# EAGLE schematic maintenance_panel (EAGLE 6.6.0)
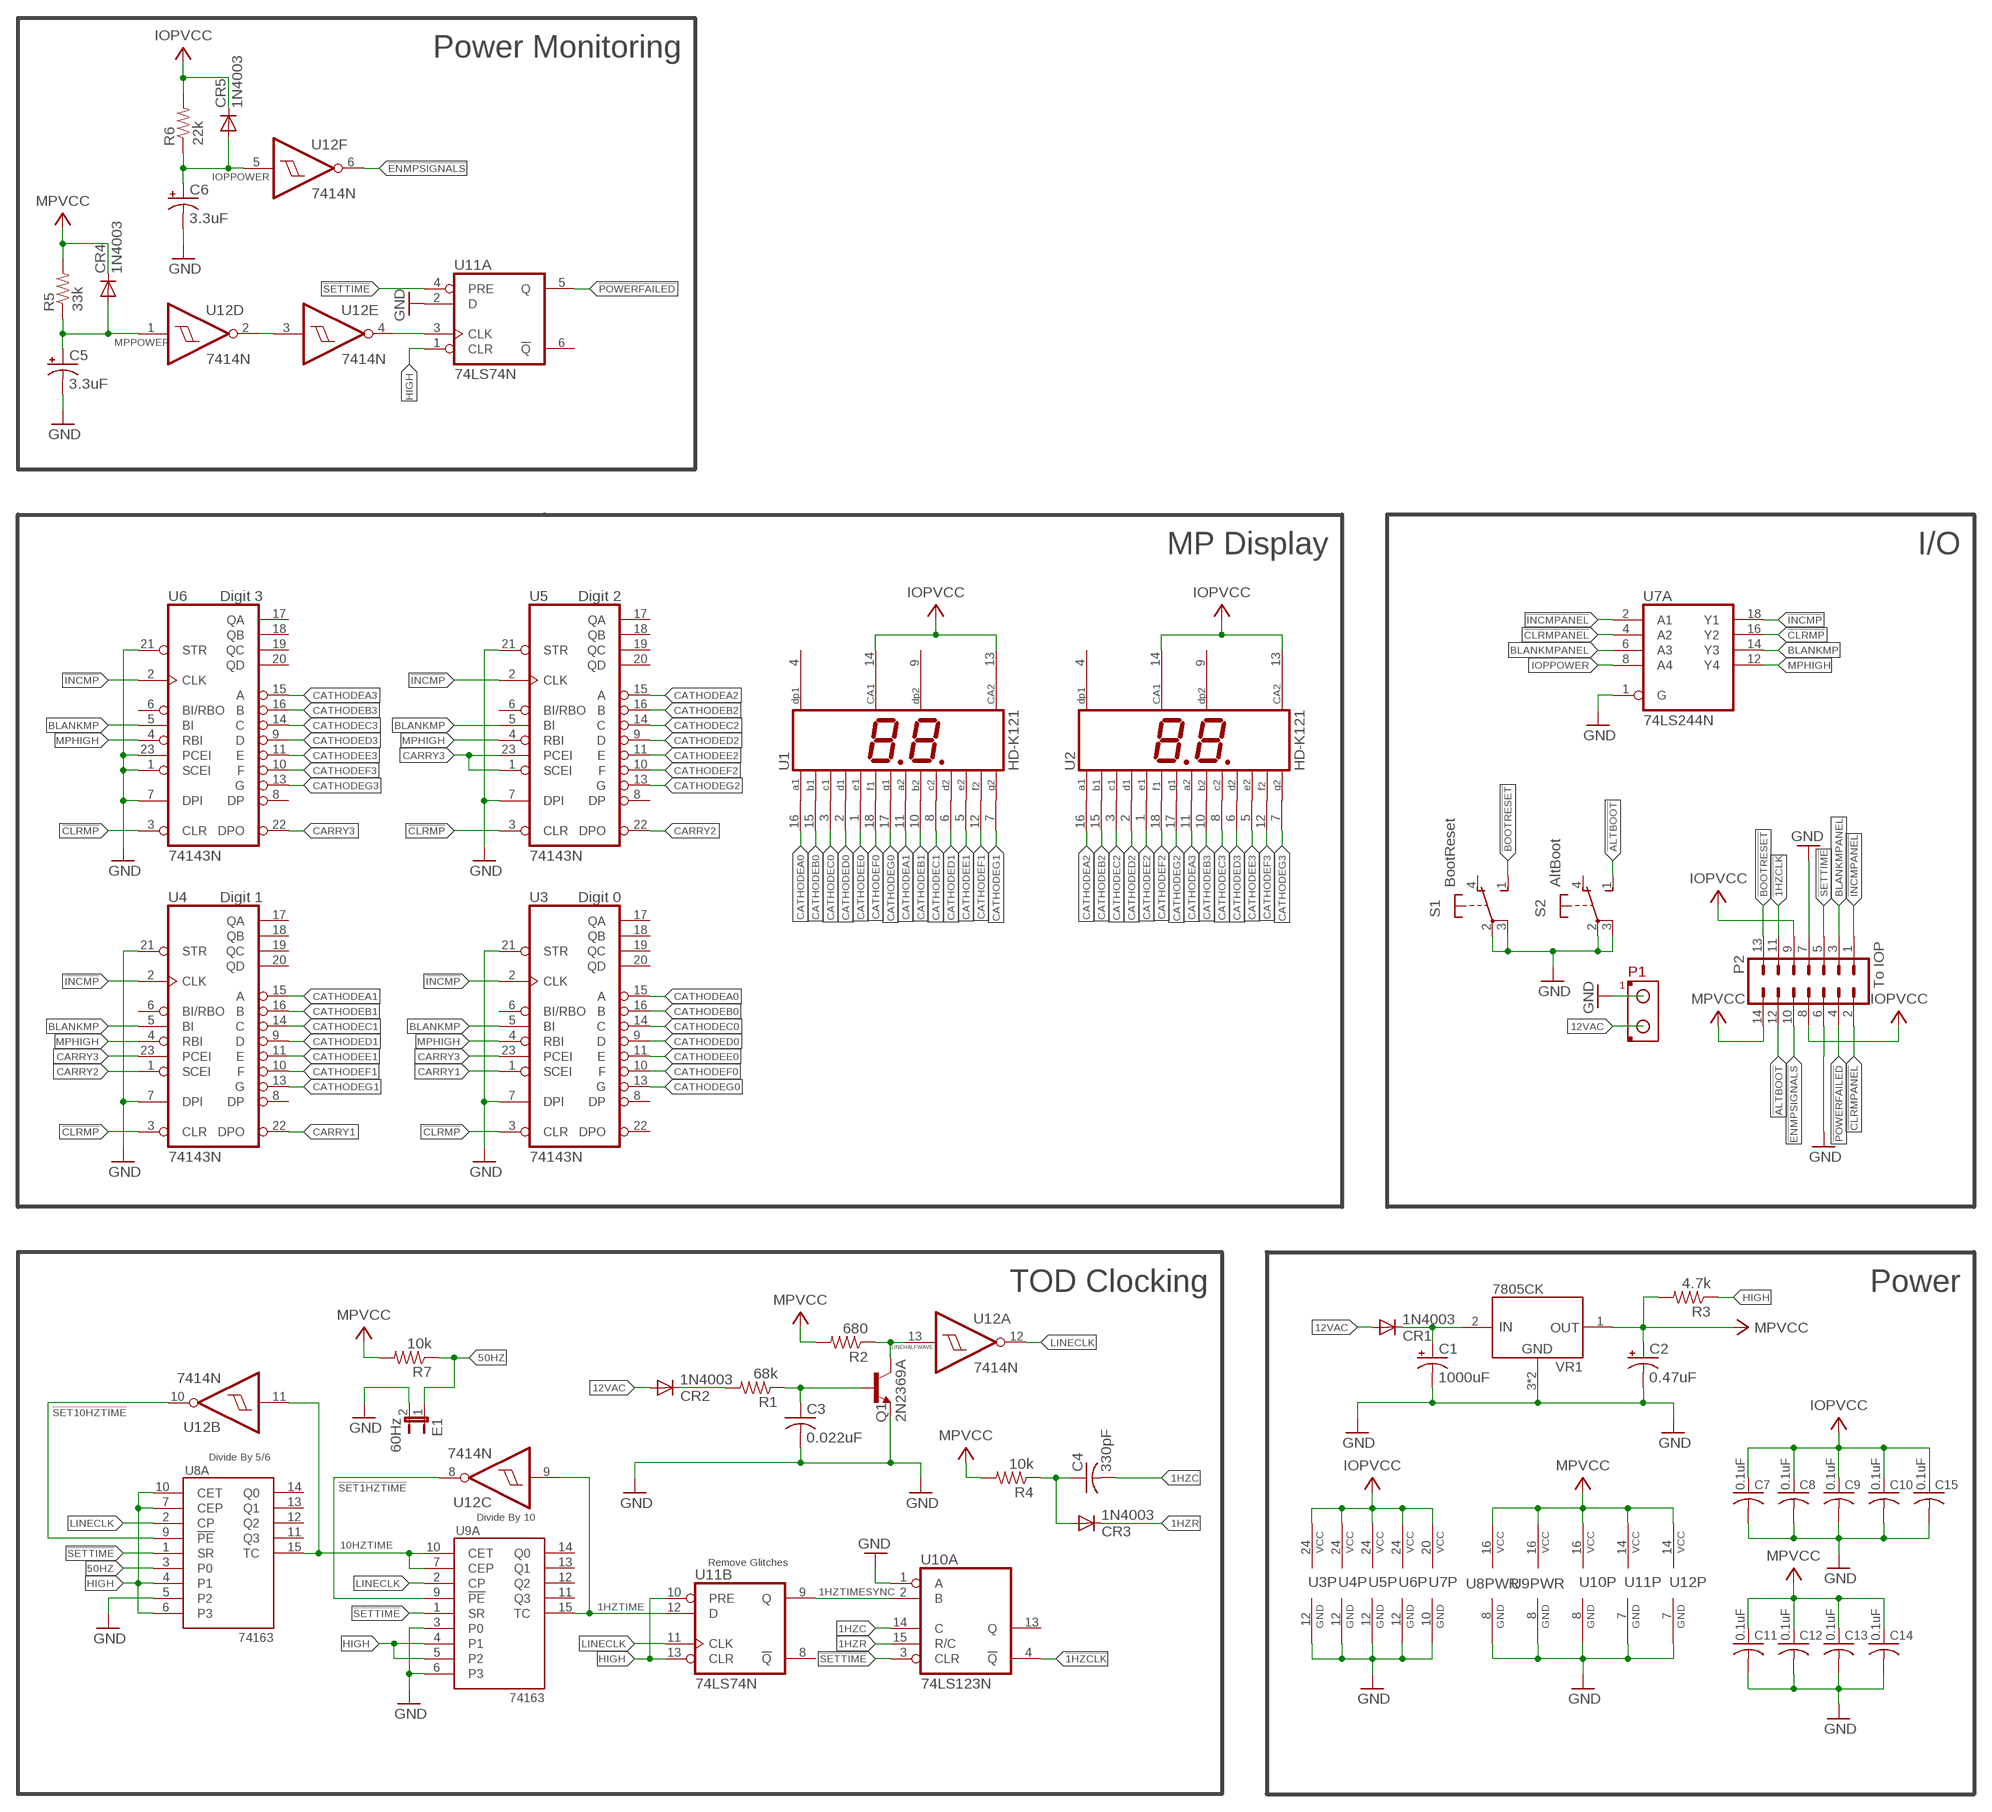
[diagram p0: schematic, sheet 1]

## Parts
C1  1000uF  CPOL-USE25-10AXIAL  [E25-10]
C2  0.47uF  CPOL-USE15-5AXIAL  [E15-5]
C3  0.022uF  C-US075-052X106  [C075-052X106]
C4  330pF  C-US075-032X103  [C075-032X103]
C5  3.3uF  CPOL-USE15-5AXIAL  [E15-5]
C6  3.3uF  CPOL-USE15-5AXIAL  [E15-5]
C7  0.1uF  C-US075-032X103  [C075-032X103]
C8  0.1uF  C-US075-032X103  [C075-032X103]
C9  0.1uF  C-US075-032X103  [C075-032X103]
C10  0.1uF  C-US075-032X103  [C075-032X103]
C11  0.1uF  C-US075-032X103  [C075-032X103]
C12  0.1uF  C-US075-032X103  [C075-032X103]
C13  0.1uF  C-US075-032X103  [C075-032X103]
C14  0.1uF  C-US075-032X103  [C075-032X103]
C15  0.1uF  C-US075-032X103  [C075-032X103]
CR1  1N4003  1N4004  [DO41-10]
CR2  1N4003  1N4004  [DO41-10]
CR3  1N4003  1N4004  [DO41-10]
CR4  1N4003  1N4004  [DO41-10]
CR5  1N4003  1N4004  [DO41-10]
E1  60Hz  JP1E  [JP1]
P1  XEROX-RTC-2X1  [XEROX-RTC-2X1]
P2  To IOP  MA07-2  [MA07-2]
Q1  2N2369A  2N2369A-NPN-TO18-EBC  [TO18]
R1  68k  R-US_0207/10  [0207/10]
R2  680  R-US_0207/10  [0207/10]
R3  4.7k  R-US_0207/10  [0207/10]
R4  10k  R-US_0207/10  [0207/10]
R5  33k  R-US_0207/10  [0207/10]
R6  22k  R-US_0207/10  [0207/10]
R7  10k  R-US_0207/10  [0207/10]
S1  BootReset  SRK  [SRK]
S2  AltBoot  SRK  [SRK]
U1  HD-K121  [HDSP-R]
U2  HD-K121  [HDSP-R]
U3  74143N  [DIL24-6]
U4  74143N  [DIL24-6]
U5  74143N  [DIL24-6]
U6  74143N  [DIL24-6]
U7  74LS244N  [DIL20]
U8  74163  [DIL16]
U9  74163  [DIL16]
U10  74LS123N  [DIL16]
U11  74LS74N  [DIL14]
U12  7414N  [DIL14]
VR1  7805CK  [TO3-78]

## Nets
1HZC: C4.2 U10.14(A:C)
1HZR: CR3.C U10.15(A:R/C)
1HZTIME: U9.15(A:TC) U11.12(B:D) U12.9(C:I)
1HZTIMESYNC: U10.2(A:B) U11.9(B:Q)
10HZTIME: U8.15(A:TC) U9.7(A:CEP) U9.10(A:CET) U12.11(B:I)
12VAC: CR1.A CR2.A P1.2
50HZ: E1.1 R7.1 U8.3(A:P0)
!1HZCLK: P2.11 U10.4(A:!Q)
!ALTBOOT: P2.12 S2.1(S)
!BOOTRESET: P2.13 S1.1(S)
!CLRMP: U3.3(CLR) U4.3(CLR) U5.3(CLR) U6.3(CLR) U7.16(A:Y2)
!CLRMPANEL: P2.2 U7.4(A:A2)
!ENMPSIGNALS: P2.10 U12.6(F:O)
!INCMP: U3.2(CLK) U4.2(CLK) U5.2(CLK) U6.2(CLK) U7.18(A:Y1)
!INCMPANEL: P2.1 U7.2(A:A1)
!POWERFAILED: P2.4 U11.5(A:Q)
!SET1HZTIME: U9.9(A:!PE) U12.8(C:O)
!SET10HZTIME: U8.9(A:!PE) U12.10(B:O)
!SETTIME: P2.5 U8.1(A:SR) U9.1(A:SR) U10.3(A:CLR) U11.4(A:PRE)
+12VAC: C1.+ CR1.C VR1.2(IN)
+12VAC-2: CR2.C R1.2
BLANKMP: U3.5(BI) U4.5(BI) U5.5(BI) U6.5(BI) U7.14(A:Y3)
BLANKMPANEL: P2.3 U7.6(A:A3)
CARRY1: U3.1(SCEI) U4.22(DPO)
CARRY2: U4.1(SCEI) U5.22(DPO)
CARRY3: U3.23(PCEI) U4.23(PCEI) U5.1(SCEI) U5.23(PCEI) U6.22(DPO)
CATHODEA0: U1.16(A1) U3.15(A)
CATHODEA1: U1.11(A2) U4.15(A)
CATHODEA2: U2.16(A1) U5.15(A)
CATHODEA3: U2.11(A2) U6.15(A)
CATHODEB0: U1.15(B1) U3.16(B)
CATHODEB1: U1.10(B2) U4.16(B)
CATHODEB2: U2.15(B1) U5.16(B)
CATHODEB3: U2.10(B2) U6.16(B)
CATHODEC0: U1.3(C1) U3.14(C)
CATHODEC1: U1.8(C2) U4.14(C)
CATHODEC2: U2.3(C1) U5.14(C)
CATHODEC3: U2.8(C2) U6.14(C)
CATHODED0: U1.2(D1) U3.9(D)
CATHODED1: U1.6(D2) U4.9(D)
CATHODED2: U2.2(D1) U5.9(D)
CATHODED3: U2.6(D2) U6.9(D)
CATHODEE0: U1.1(E1) U3.11(E)
CATHODEE1: U1.5(E2) U4.11(E)
CATHODEE2: U2.1(E1) U5.11(E)
CATHODEE3: U2.5(E2) U6.11(E)
CATHODEF0: U1.18(F1) U3.10(F)
CATHODEF1: U1.12(F2) U4.10(F)
CATHODEF2: U2.18(F1) U5.10(F)
CATHODEF3: U2.12(F2) U6.10(F)
CATHODEG0: U1.17(G1) U3.13(G)
CATHODEG1: U1.7(G2) U4.13(G)
CATHODEG2: U2.17(G1) U5.13(G)
CATHODEG3: U2.7(G2) U6.13(G)
GND: C1.- C2.- C3.2 C5.- C6.- C7.2 C8.2 C9.2 C10.2 C11.2 C12.2 C13.2 C14.2 C15.2 E1.2 P1.1 P2.6 P2.7 Q1.1(E) S1.2(P) S1.3(P) S2.2(P) S2.3(P) U3.7(DPI) U3.12(GND) U3.21(STR) U4.7(DPI) U4.12(GND) U4.21(STR) U5.7(DPI) U5.12(GND) U5.21(STR) U6.1(SCEI) U6.7(DPI) U6.12(GND) U6.21(STR) U6.23(PCEI) U7.1(A:G) U7.10(P:GND) U8.5(A:P2) U8.8(PWR:GND) U9.3(A:P0) U9.6(A:P3) U9.8(PWR:GND) U10.1(A:A) U10.8(P:GND) U11.2(A:D) U11.7(P:GND) U12.7(P:GND) VR1.3(GND) VR1.3@(GND)
HIGH: R3.1 U8.4(A:P1) U8.6(A:P3) U8.7(A:CEP) U8.10(A:CET) U9.4(A:P1) U9.5(A:P2) U11.1(A:CLR) U11.10(B:PRE) U11.13(B:CLR)
IOPPOWER: C6.+ CR5.A R6.1 U7.8(A:A4) U12.5(F:I)
IOPVCC: C7.1 C8.1 C9.1 C10.1 C15.1 CR5.C P2.8 P2.9 R6.2 U1.13(CA2) U1.14(CA1) U2.13(CA2) U2.14(CA1) U3.24(VCC) U4.24(VCC) U5.24(VCC) U6.24(VCC) U7.20(P:VCC)
LINECLK: U8.2(A:CP) U9.2(A:CP) U11.11(B:CLK) U12.12(A:O)
LINEHALFWAVE: Q1.3(C) R2.1 U12.13(A:I)
LINEHALFWAVE-PREQ: C3.1 Q1.2(B) R1.1
MPHIGH: U3.4(RBI) U4.4(RBI) U5.4(RBI) U6.4(RBI) U7.12(A:Y4)
MPP1: U12.2(D:O) U12.3(E:I)
MPP2: U11.3(A:CLK) U12.4(E:O)
MPPOWER: C5.+ CR4.A R5.1 U12.1(D:I)
MPVCC: C2.+ C11.1 C12.1 C13.1 C14.1 CR4.C P2.14 R2.2 R3.2 R4.2 R5.2 R7.2 U8.16(PWR:VCC) U9.16(PWR:VCC) U10.16(P:VCC) U11.14(P:VCC) U12.14(P:VCC) VR1.1(OUT)
N$1: C4.1 CR3.A R4.1
Unconnected: S1.4(O) S2.4(O) U1.4(DP1) U1.9(DP2) U2.4(DP1) U2.9(DP2) U3.6(BI/RBO) U3.8(DP) U3.17(QA) U3.18(QB) U3.19(QC) U3.20(QD) U3.22(DPO) U4.6(BI/RBO) U4.8(DP) U4.17(QA) U4.18(QB) U4.19(QC) U4.20(QD) U5.6(BI/RBO) U5.8(DP) U5.17(QA) U5.18(QB) U5.19(QC) U5.20(QD) U6.6(BI/RBO) U6.8(DP) U6.17(QA) U6.18(QB) U6.19(QC) U6.20(QD) U7.3(B:Y4) U7.5(B:Y3) U7.7(B:Y2) U7.9(B:Y1) U7.11(B:A1) U7.13(B:A2) U7.15(B:A3) U7.17(B:A4) U7.19(B:G) U8.11(A:Q3) U8.12(A:Q2) U8.13(A:Q1) U8.14(A:Q0) U9.11(A:Q3) U9.12(A:Q2) U9.13(A:Q1) U9.14(A:Q0) U10.5(B:Q) U10.6(B:C) U10.7(B:R/C) U10.9(B:A) U10.10(B:B) U10.11(B:CLR) U10.12(B:!Q) U10.13(A:Q) U11.6(A:!Q) U11.8(B:!Q)

## Notes on the sheet
- Power Monitoring
- MP Display | I/O
- Digit 3 | Digit 2
- Digit 1 | Digit 0
- TOD Clocking | Power
- Divide By 5/6
- Divide By 10
- Remove Glitches

## Library data of the parts
C1 C2 C5 C6 = rcl:CPOL-US: POLARIZED CAPACITOR, American symbol
C3 C4 C7-C15 = rcl:C-US: CAPACITOR, American symbol
CR1-CR5 = diode:1N4004: DIODE general purpose rectifier, 1 A
E1 = jumper:JP1E: JUMPER
P1 = con-sen:XEROX-RTC-2X1
P2 = con-lstb:MA07-2: PIN HEADER; OC_FARNELL: unknown; OC_NEWARK: unknown
Q1 = transistor:*-NPN-: NPN Transistror BF959 corrected 2008.03.06
R1-R7 = rcl:R-US_: RESISTOR, American symbol
S1 S2 = switch-misc:SRK: SWITCH
U1 U2 = display-hp:HD-K121: LED DISPLAY 2 x 1 character 7 segment, decimal points right; OC_FARNELL: unknown; OC_NEWARK: unknown
U3-U6 = 74xx-us:74*143: 4-bit COUNTER/LATCH SEVEN-SEGMENT LED/LAMP DRIVER
U7 = 74xx-us:74*244: Octal BUFFER and LINE DRIVER, 3-state
U8 U9 = 74xx-sen:74*163: 4-bit binary counter w/ synchronous reset
U10 = 74xx-us:74*123: Retriggerable monostable MULTIVIBRATOR
U11 = 74xx-us:74*74: Dual D type positive edge triggered FLIP FLOP, preset and clear
U12 = 74xx-us:74*14: Hex schmitt trigger INVERTER
VR1 = vreg-sen:7805